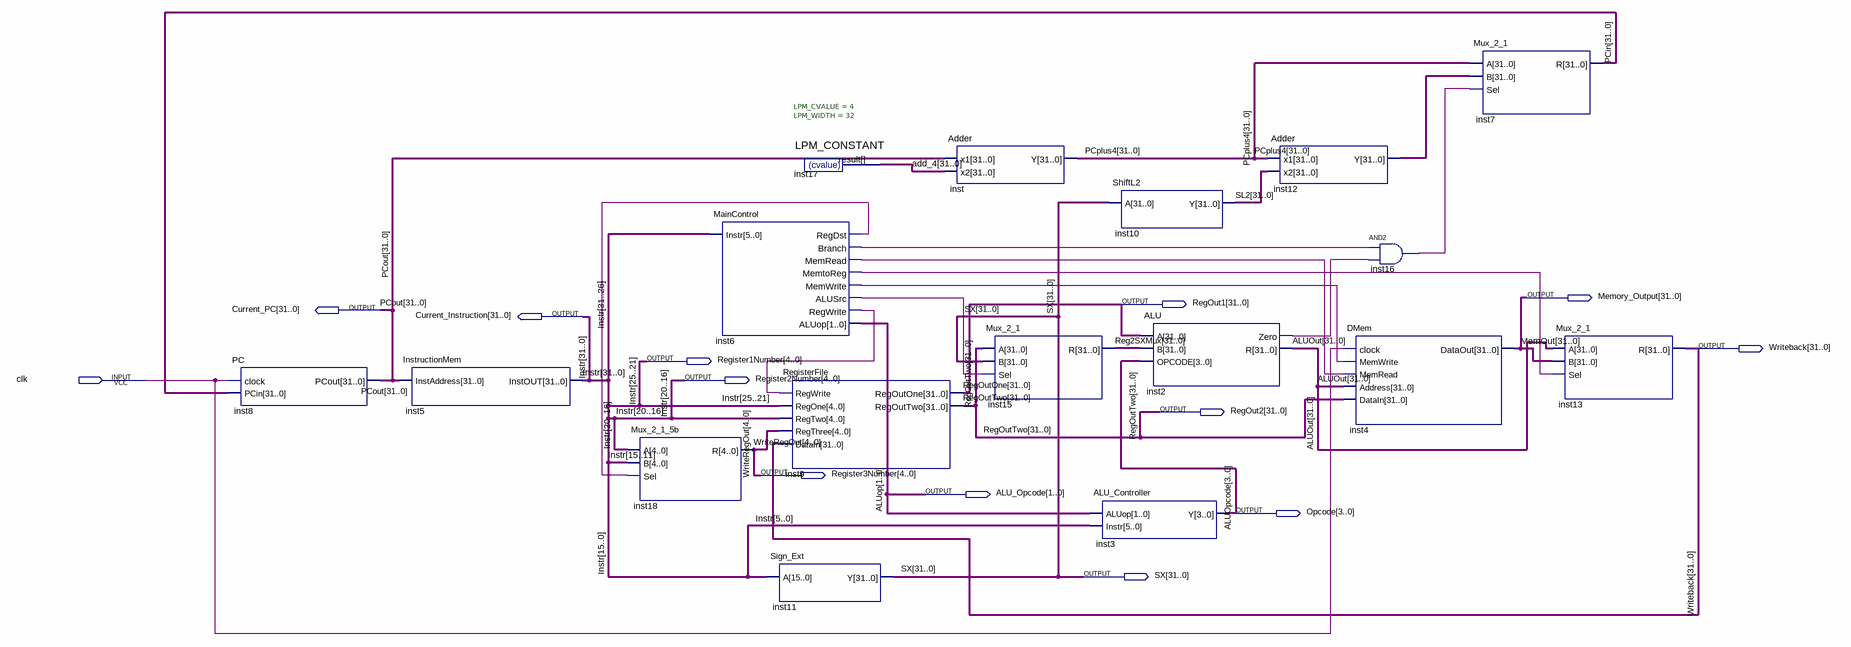
[diagram p0: schematic sheet]
// Quartus schematic Datapath.bdf as structural Verilog: 17 symbols, 13 pins
module Datapath (
  input  clk,
  output [31:0] Memory_Output,
  output [31:0] RegOut1,
  output [31:0] Current_PC,
  output [31:0] Current_Instruction,
  output [31:0] Writeback,
  output [4:0] Register1Number,
  output [4:0] Register2Number,
  output [31:0] RegOut2,
  output [4:0] Register3Number,
  output [1:0] ALU_Opcode,
  output [3:0] Opcode,
  output [31:0] SX
);

  wire inst2_zero, inst6_alusrc, inst6_branch, inst6_memread, inst6_memtoreg, inst6_memwrite, inst6_regdst,
       inst6_regwrite, inst16_out;
  wire [31:0] add_4, ALUOut, inst12_y, PCin, PCplus4, Reg2SXMux, SL2;

  PC inst8 (.clock(clk), .PCin(PCin), .PCout(Current_PC));
  InstructionMem inst5 (.InstAddress(Current_PC), .InstOUT(Current_Instruction));
  Mux_2_1_5b inst18 (
    .A(Current_Instruction[20:16]), .B(Current_Instruction[15:11]), .Sel(inst6_regdst), .R(Register3Number));
  MainControl inst6 (
    .Instr(Current_Instruction[31:26]), .RegDst(inst6_regdst), .Branch(inst6_branch),
    .MemRead(inst6_memread), .MemtoReg(inst6_memtoreg), .MemWrite(inst6_memwrite), .ALUSrc(inst6_alusrc),
    .RegWrite(inst6_regwrite), .ALUop(ALU_Opcode));
  LPM_CONSTANT #(.LPM_CVALUE(4), .LPM_WIDTH(32)) inst17 (.result(add_4));
  RegisterFile inst9 (
    .RegWrite(inst6_regwrite), .RegOne(Current_Instruction[25:21]), .RegTwo(Current_Instruction[20:16]),
    .RegThree(Register3Number), .DataIn(Writeback), .RegOutOne(RegOut1), .RegOutTwo(RegOut2));
  Sign_Ext inst11 (.A(Current_Instruction[15:0]), .Y(SX));
  Adder inst (.x1(Current_PC), .x2(add_4), .Y(PCplus4));
  Mux_2_1 inst15 (.A(RegOut2), .B(SX), .Sel(inst6_alusrc), .R(Reg2SXMux));
  ALU_Controller inst3 (.ALUop(ALU_Opcode), .Instr(Current_Instruction[5:0]), .Y(Opcode));
  ShiftL2 inst10 (.A(SX), .Y(SL2));
  ALU inst2 (.A(RegOut1), .B(Reg2SXMux), .OPCODE(Opcode), .Zero(inst2_zero), .R(ALUOut));
  Adder inst12 (.x1(PCplus4), .x2(SL2), .Y(inst12_y));
  DMem inst4 (
    .clock(clk), .MemWrite(inst6_memwrite), .MemRead(inst6_memread), .Address(ALUOut), .DataIn(RegOut2),
    .DataOut(Memory_Output));
  and inst16 (inst16_out, inst6_branch, inst2_zero);
  Mux_2_1 inst7 (.A(PCplus4), .B(inst12_y), .Sel(inst16_out), .R(PCin));
  Mux_2_1 inst13 (.A(ALUOut), .B(Memory_Output), .Sel(inst6_memtoreg), .R(Writeback));

  assign Register1Number = Current_Instruction[25:21];
  assign Register2Number = Current_Instruction[20:16];

  // Other names for the same wires on the sheet: ALUop[1:0] = ALU_Opcode; ALUOpcode[3:0] = Opcode;
  //   Instr[31:0] = Current_Instruction; MemOut[31:0] = Memory_Output; PCout[31:0] = Current_PC;
  //   WriteRegOut[4:0] = Register3Number; RegOutOne[31:0] = RegOut1; RegOutTwo[31:0] = RegOut2
endmodule
